# Altium schematic sheet QCopterMV-Camera_Sch.SchDoc: QCopterMV-Camera
size 177 x 127 mm; Author: Hom; CompanyName: KitSprout; DrawnBy: Hom; Engineer: Hom; Organization: KitSprout; Revision: A; SheetNumber: 1; SheetTotal: 1; Version: 2.0; LibVersion: 2.7; PageSetup: Record=PageOptions|CenterHorizontal=True|CenterVertical=True|PrintScale=1.00|XCorrection=1.00|YCorrection=1.00|PrintKind=0|BorderSize=5000000|LeftOffset=0|BottomOffset=0|Orientation=2|PaperLength=1000|PaperWidth=1000|Scale=100|PaperSource=7|PrintQuality=-3|MediaType=1|DitherType=10|PrintScaleMode=0|PaperKind=A4|PaperIndex=9
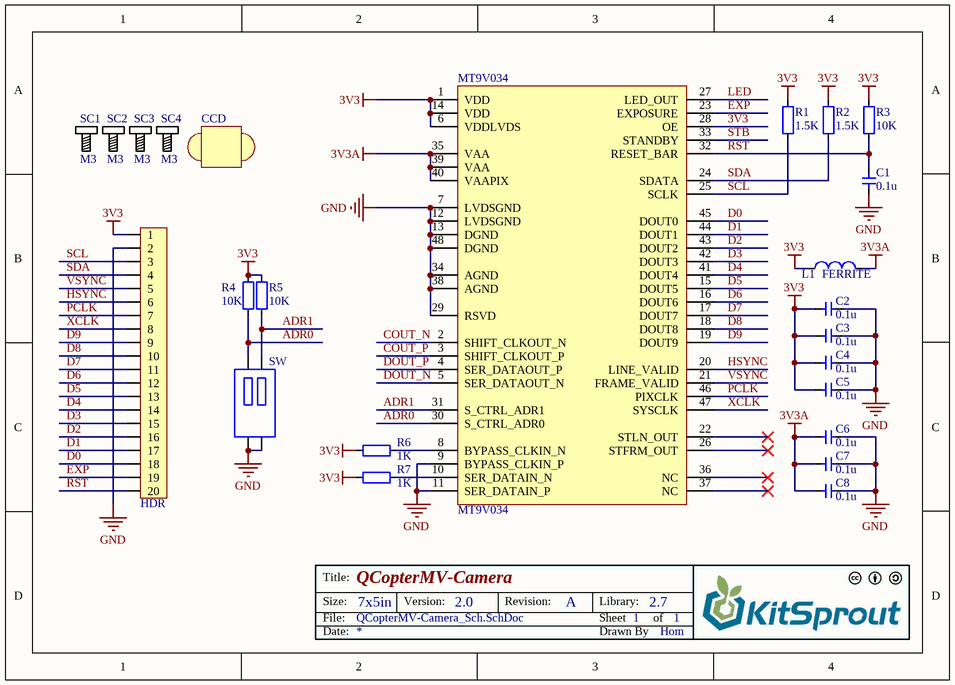
[diagram p0: QCopterMV-Camera_Sch.SchDoc]

## Parts
C1  value 0.1u  [CAP_0603]  (hidden comment: Cap_0603)
C2  value 0.1u  [CAP_0603]  (hidden comment: Cap_0603)
C3  value 0.1u  [CAP_0603]  (hidden comment: Cap_0603)
C4  value 0.1u  [CAP_0603]  (hidden comment: Cap_0603)
C5  value 0.1u  [CAP_0603]  (hidden comment: Cap_0603)
C6  value 0.1u  [CAP_0603]  (hidden comment: Cap_0603)
C7  value 0.1u  [CAP_0603]  (hidden comment: Cap_0603)
C8  value 0.1u  [CAP_0603]  (hidden comment: Cap_0603)
CCD  CCD  [CCD_LENS_20MM]  (value not drawn)
HDR  HDR1x20_1.27  [HDR1X20_1.27_180]  (value not drawn)
L1  value FERRITE  [IND_0603]  (hidden comment: Ind_0603)
MT9V034  MT9V034  [CLCC_48]
R1  value 1.5K  [RES_0603]  (hidden comment: Res_0603)
R2  value 1.5K  [RES_0603]  (hidden comment: Res_0603)
R3  value 10K  [RES_0603]  (hidden comment: Res_0603)
R4  value 10K  [RES_0603]  (hidden comment: Res_0603)
R5  value 10K  [RES_0603]  (hidden comment: Res_0603)
R6  value 1K  [RES_0603]  (hidden comment: Res_0603)
R7  value 1K  [RES_0603]  (hidden comment: Res_0603)
SC1  M3  [SCRREW_M3]
SC2  M3  [SCRREW_M3]
SC3  M3  [SCRREW_M3]
SC4  M3  [SCRREW_M3]
SW  SwitchSPST_2P  [SwitchSPDT_P2_180]  (value not drawn)

## Nets
3V3: C2.2 C3.2 C4.2 C5.2 HDR.1 L1.1 MT9V034.1(VDD) MT9V034.6(VDDLVDS) MT9V034.14(VDD) MT9V034.28(OE) R1.2 R2.2 R3.2 R4.2 R5.2 R6.2 R7.2
3V3A: C6.2 C7.2 C8.2 L1.2 MT9V034.35(VAA) MT9V034.39(VAA) MT9V034.40(VAAPIX)
GND: C1.1 C2.1 C3.1 C4.1 C5.1 C6.1 C7.1 C8.1 HDR.2 MT9V034.7(LVDSGND) MT9V034.9(BYPASS_CLKIN_P) MT9V034.11(SER_DATAIN_P) MT9V034.12(LVDSGND) MT9V034.13(DGND) MT9V034.29(RSVD) MT9V034.34(AGND) MT9V034.38(AGND) MT9V034.48(DGND) SW.1(COMMON) SW.2(COMMON)
ADR0: MT9V034.30(S_CTRL_ADR0) R4.1 SW.1ON(ON)
ADR1: MT9V034.31(S_CTRL_ADR1) R5.1 SW.2ON(NO)
COUT_N: MT9V034.2(SHIFT_CLKOUT_N)
COUT_P: MT9V034.3(SHIFT_CLKOUT_P)
D0: HDR.18 MT9V034.45(DOUT0)
D1: HDR.17 MT9V034.44(DOUT1)
D2: HDR.16 MT9V034.43(DOUT2)
D3: HDR.15 MT9V034.42(DOUT3)
D4: HDR.14 MT9V034.41(DOUT4)
D5: HDR.13 MT9V034.15(DOUT5)
D6: HDR.12 MT9V034.16(DOUT6)
D7: HDR.11 MT9V034.17(DOUT7)
D8: HDR.10 MT9V034.18(DOUT8)
D9: HDR.9 MT9V034.19(DOUT9)
DOUT_N: MT9V034.5(SER_DATAOUT_N)
DOUT_P: MT9V034.4(SER_DATAOUT_P)
EXP: HDR.19 MT9V034.23(EXPOSURE)
HSYNC: HDR.6 MT9V034.20(LINE_VALID)
LED: MT9V034.27(LED_OUT)
PCLK: HDR.7 MT9V034.46(PIXCLK)
RST: C1.2 HDR.20 MT9V034.32(RESET_BAR) R3.1
SCL: HDR.3 MT9V034.25(SCLK) R1.1
SDA: HDR.4 MT9V034.24(SDATA) R2.1
STB: MT9V034.33(STANDBY)
VSYNC: HDR.5 MT9V034.21(FRAME_VALID)
XCLK: HDR.8 MT9V034.47(SYSCLK)
NetMT9V034_8: MT9V034.8(BYPASS_CLKIN_N) R6.1
NetMT9V034_10: MT9V034.10(SER_DATAIN_N) R7.1

Not connected (* = marked no-connect by the designer): MT9V034 22(STLN_OUT)* 26(STFRM_OUT)* 36(NC)* 37(NC)*

## Notes on the sheet
- Title:
- Size:
- Date:
- File:
- 7x5in
- Version:
- Revision:
- Sheet
- Drawn By
- Library:
- of

## Library data of the parts
C1-C8 = Cap_0603: Capacitor
CCD = lensCCD_20
HDR = HDR1x20_1.27: Header
L1 = Ind_0603: Inductor
MT9V034 = MT9V034: CMOS
R1-R7 = Res_0603: Resistor
SC1-SC4 = Screw_M3: Screw
SW = SwitchSPST_2P: Switch